# EAGLE design rf_board_v1 (EAGLE 5.11)
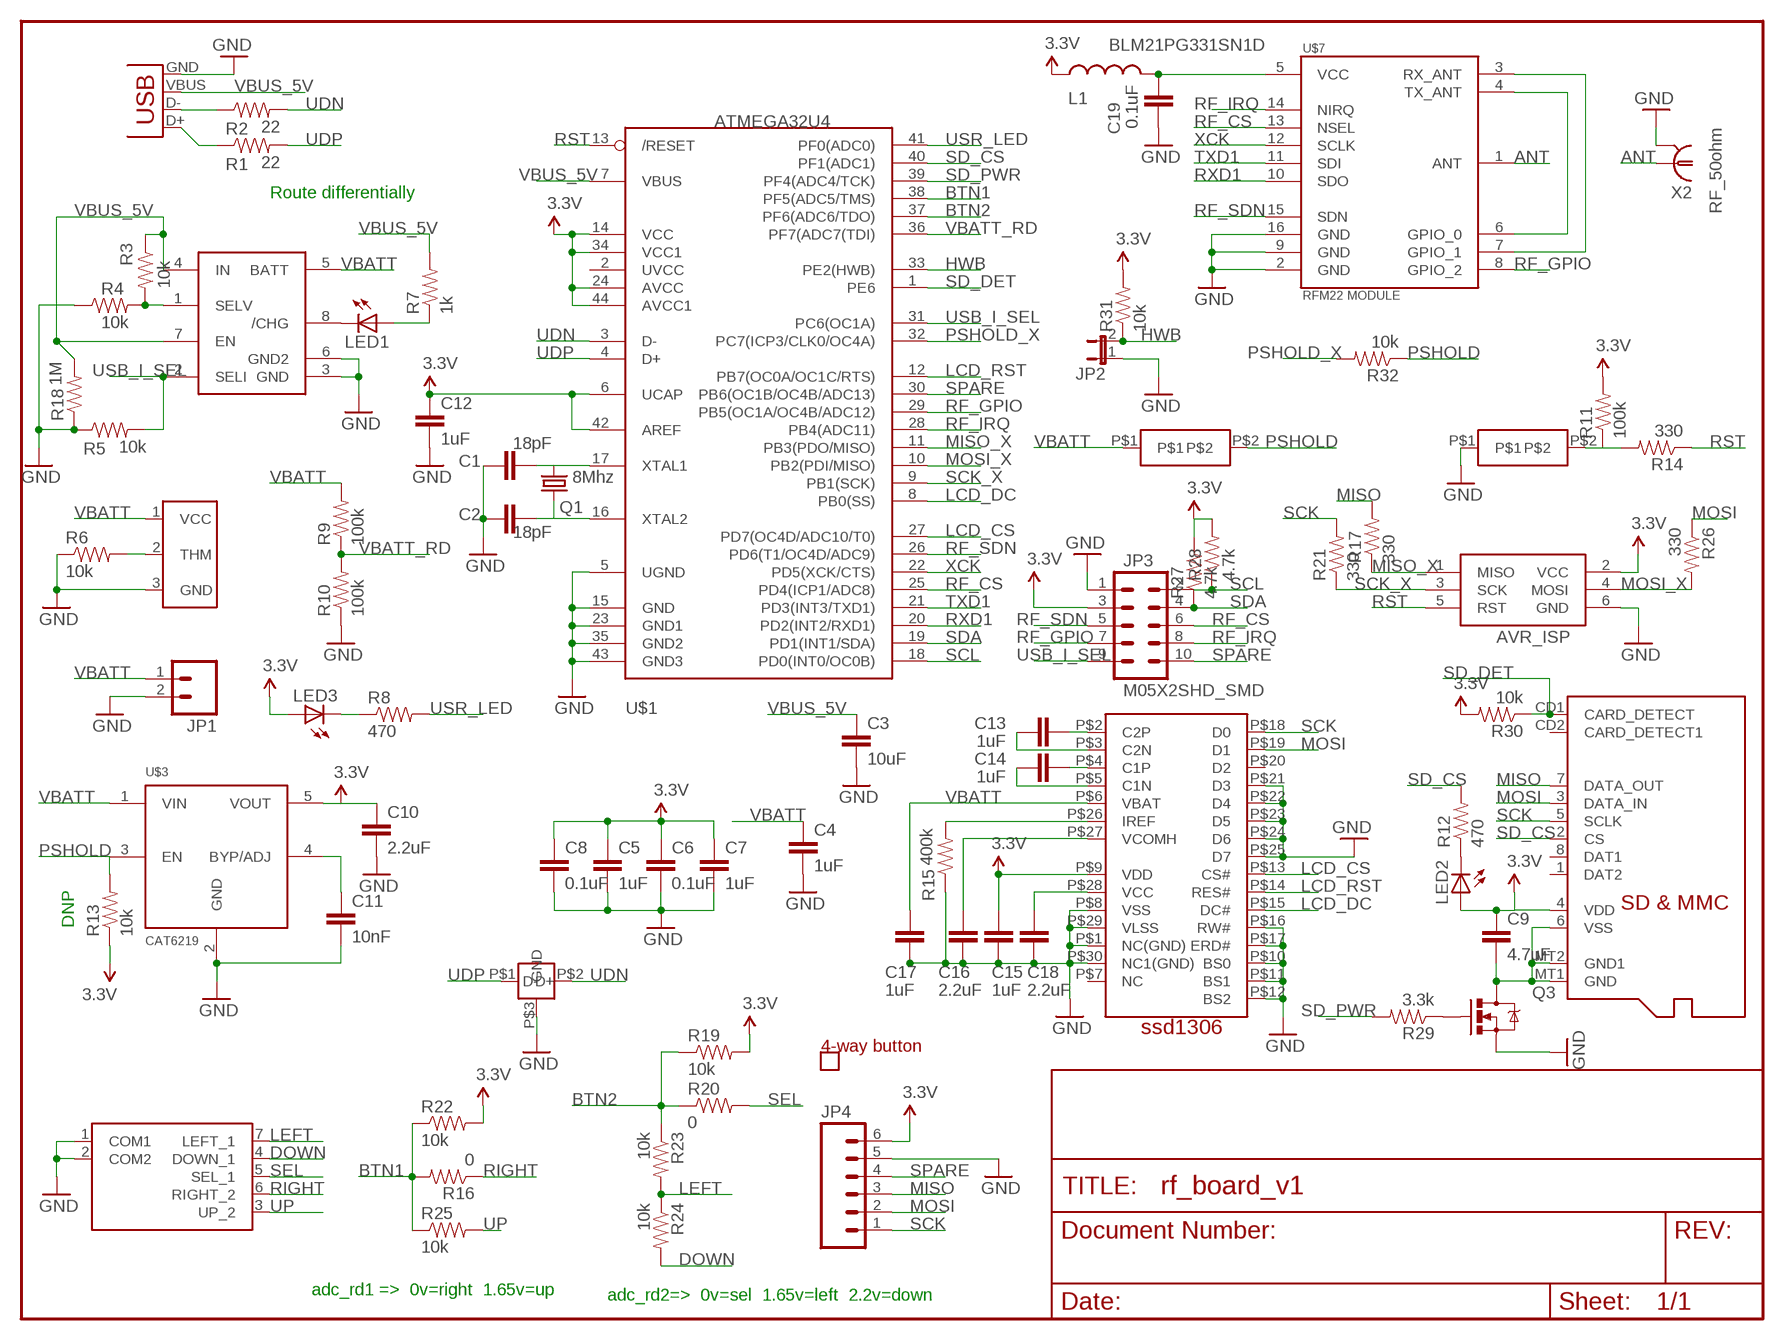
[diagram p0: schematic, sheet 1]

## Parts
AVR_ISP  AVRISP-6  [AVRISP]
C1  18pF  CAP0603-CAP  [0603-CAP]
C2  18pF  CAP0603-CAP  [0603-CAP]
C3  10uF  CAP0805  [0805]
C4  1uF  CAP0805  [0805]
C5  1uF  CAP0805  [0805]
C6  0.1uF  CAP0805  [0805]
C7  1uF  CAP0805  [0805]
C8  0.1uF  CAP0805  [0805]
C9  4.7uF  CAP0805  [0805]
C10  2.2uF  CAP0805  [0805]
C11  10nF  CAP0805  [0805]
C12  1uF  CAP0805  [0805]
C13  1uF  CAP0805  [0805]
C14  1uF  CAP0805  [0805]
C15  1uF  CAP0805  [0805]
C16  2.2uF  CAP0805  [0805]
C17  1uF  CAP0805  [0805]
C18  2.2uF  CAP0805  [0805]
C19  0.1uF  CAP0805  [0805]
JP1  M02PTH4  [1X02_XTRA_BIG]
JP2  JUMPER-2PTH_LOCK  [1X02_LOCK]
JP3  M05X2SHD_SMD  [2X5-SHROUDED_SMD]
JP4  M06LOCK  [1X06_LOCK]
L1  BLM21PG331SN1D  INDUCTOR0805  [0805]
LED1  LED1206  [LED-1206]
LED2  LED1206  [LED-1206]
LED3  LED1206  [LED-1206]
MICROSD  MICROSD  [MICROSD]
Q1  8Mhz  CRYSTALSMD  [HC49UP]
Q3  NFET  MOSFET-NCHANNELSMD  [SOT23-3]
R1  22  RESISTOR  [0805]
R2  22  RESISTOR  [0805]
R3  10k  RESISTOR  [0805]
R4  10k  RESISTOR  [0805]
R5  10k  RESISTOR  [0805]
R6  10k  RESISTOR  [0805]
R7  1k  RESISTOR  [0805]
R8  470  RESISTOR  [0805]
R9  100k  RESISTOR  [0805]
R10  100k  RESISTOR  [0805]
R11  100k  RESISTOR  [0805]
R12  470  RESISTOR  [0805]
R13  10k  RESISTOR  [0805]
R14  330  RESISTOR  [0805]
R15  400k  RESISTOR  [0805]
R16  0  RESISTOR  [0805]
R17  330  RESISTOR  [0805]
R18  1M  RESISTOR  [0805]
R19  10k  RESISTOR  [0805]
R20  0  RESISTOR  [0805]
R21  330  RESISTOR  [0805]
R22  10k  RESISTOR  [0805]
R23  10k  RESISTOR  [0805]
R24  10k  RESISTOR  [0805]
R25  10k  RESISTOR  [0805]
R26  330  RESISTOR  [0805]
R27  4.7k  RESISTOR  [0805]
R28  4.7k  RESISTOR  [0805]
R29  3.3k  RESISTOR  [0805]
R30  10k  RESISTOR  [0805]
R31  10k  RESISTOR  [0805]
R32  10k  RESISTOR  [0805]
U$1  ATMEGA32U4  ATMEGA32U4-AU  [TQFP44]
U$2  MAX1811  MAX1811SO8  [SO08]
U$3  CAT6219  CAT6219-TD  [SOT23-5]
U$4  JST_CON  [JST_CON]
U$6  ESD_TPD2EUSB30ADRTR  [TPD2EUSB30ADRTR]
U$7  RFM22 MODULE  RFM22  [RFM22-XXX-S2]
U$8  TPA511GLFS  [TPA511GLFS]
U$10  SSD1306  [SSD1306]
U$11  SW_KSS343GLFG  [SW_KSS343GLFG]
U$12  SW_KSS343GLFG  [SW_KSS343GLFG]
X1  USB-MICROB  [USB-MICROB]
X2  RF_50ohm  LTI-SASF54GT  [LTI-SASF54GT]

## Nets
3.3V: AVR_ISP.2(VCC) C5.1 C6.1 C7.1 C8.1 C9.1 C10.1 C12.1 C15.2 JP3.3 JP4.6 L1.1 LED2.A LED3.A MICROSD.4(VDD) R11.2 R13.1 R19.2 R22.2 R27.2 R28.2 R30.2 R31.2 U$1.6(UCAP) U$1.14(VCC) U$1.24(AVCC) U$1.34(VCC1) U$1.42(AREF) U$1.44(AVCC1) U$3.5(VOUT) U$10.P$9(VDD)
ANT: U$7.1(ANT) X2.1
BTN1: R16.2 R22.1 R25.1 U$1.38(PF5(ADC5/TMS))
BTN2: R19.1 R20.1 R23.1 U$1.37(PF6(ADC6/TDO))
DOWN: R24.2 U$8.4(DOWN_1)
GND: AVR_ISP.6(GND) C1.1 C2.1 C3.2 C4.2 C5.2 C6.2 C7.2 C8.2 C10.2 C11.2 C12.2 C15.1 C16.1 C17.1 C18.1 C19.1 JP1.2 JP2.1 JP3.1 JP4.5 Q3.2(S) R4.1 R5.1 R6.1 R10.1 R15.1 R18.1 U$1.5(UGND) U$1.15(GND) U$1.23(GND1) U$1.35(GND2) U$1.43(GND3) U$2.3(GND) U$2.6(GND2) U$3.2(GND) U$4.3(GND) U$6.P$3(GND) U$7.2(GND) U$7.9(GND) U$7.16(GND) U$8.1(COM1) U$8.2(COM2) U$10.P$1(NC(GND)) U$10.P$8(VSS) U$10.P$10(BS0) U$10.P$11(BS1) U$10.P$12(BS2) U$10.P$16(RW#) U$10.P$17(ERD#) U$10.P$21(D3) U$10.P$22(D4) U$10.P$23(D5) U$10.P$24(D6) U$10.P$25(D7) U$10.P$29(VLSS) U$10.P$30(NC1(GND)) U$12.P$1 X1.GND X2.2(GND)
GND1: C9.2 MICROSD.6(VSS) MICROSD.MT1(GND) MICROSD.MT2(GND1) Q3.3(D)
HWB: JP2.2 R31.1 U$1.33(PE2(HWB))
LCD_CS: U$1.27(PD7(OC4D/ADC10/T0)) U$10.P$13(CS#)
LCD_DC: U$1.8(PB0(SS)) U$10.P$15(DC#)
LCD_RST: U$1.12(PB7(OC0A/OC1C/RTS)) U$10.P$14(RES#)
LEFT: R23.2 R24.1 U$8.7(LEFT_1)
MISO: JP4.3 MICROSD.7(DATA_OUT) R17.2
MISO_X: AVR_ISP.1(MISO) R17.1 U$1.11(PB3(PDO/MISO))
MOSI: JP4.2 MICROSD.3(DATA_IN) R26.1 U$10.P$19(D1)
MOSI_X: AVR_ISP.4(MOSI) R26.2 U$1.10(PB2(PDI/MISO))
N$1: R1.1 X1.D+
N$2: R2.1 X1.D-
N$3: R3.2 R4.2 U$2.1(SELV)
N$4: C1.2 Q1.2 U$1.17(XTAL1)
N$5: C2.2 Q1.1 U$1.16(XTAL2)
N$6: Q3.1(G) R29.1
N$7: LED1.C U$2.8(/CHG)
N$8: LED1.A R7.1
N$9: U$7.3(RX_ANT) U$7.7(GPIO_1)
N$10: U$7.4(TX_ANT) U$7.6(GPIO_0)
N$11: LED3.C R8.1
N$12: R11.1 R14.2 U$12.P$2
N$14: R6.2 U$4.2(THM)
N$15: LED2.C R12.1
N$16: C11.1 U$3.4(BYP/ADJ)
N$21: C13.2 U$10.P$2(C2P)
N$22: C13.1 U$10.P$3(C2N)
N$23: C14.2 U$10.P$4(C1P)
N$24: C14.1 U$10.P$5(C1N)
N$25: R15.2 U$10.P$26(IREF)
N$26: C16.2 U$10.P$27(VCOMH)
N$27: C18.2 U$10.P$28(VCC)
N$28: C19.2 L1.2 U$7.5(VCC)
PSHOLD: R13.2 R32.1 U$3.3(EN) U$11.P$2
PSHOLD_X: R32.2 U$1.32(PC7(ICP3/CLK0/OC4A))
RF_CS: JP3.6 U$1.25(PD4(ICP1/ADC8)) U$7.13(NSEL)
RF_GPIO: JP3.7 U$1.29(PB5(OC1A/OC4B/ADC12)) U$7.8(GPIO_2)
RF_IRQ: JP3.8 U$1.28(PB4(ADC11)) U$7.14(NIRQ)
RF_SDN: JP3.5 U$1.26(PD6(T1/OC4D/ADC9)) U$7.15(SDN)
RIGHT: R16.1 U$8.6(RIGHT_2)
RST: AVR_ISP.5(RST) R14.1 U$1.13(/RESET)
RXD1: U$1.20(PD2(INT2/RXD1)) U$7.10(SDO)
SCK: JP4.1 MICROSD.5(SCLK) R21.2 U$10.P$18(D0)
SCK_X: AVR_ISP.3(SCK) R21.1 U$1.9(PB1(SCK))
SCL: JP3.2 R28.1 U$1.18(PD0(INT0/OC0B))
SD_CS: MICROSD.2(CS) R12.2 U$1.40(PF1(ADC1))
SD_DET: MICROSD.CD1(CARD_DETECT) R30.1 U$1.1(PE6)
SD_PWR: R29.2 U$1.39(PF4(ADC4/TCK))
SDA: JP3.4 R27.1 U$1.19(PD1(INT1/SDA))
SEL: R20.2 U$8.5(SEL_1)
SPARE: JP3.10 JP4.4 U$1.30(PB6(OC1B/OC4B/ADC13))
TXD1: U$1.21(PD3(INT3/TXD1)) U$7.11(SDI)
UDN: R2.2 U$1.3(D-) U$6.P$2(D-)
UDP: R1.2 U$1.4(D+) U$6.P$1(D+)
UP: R25.2 U$8.3(UP_2)
USB_I_SEL: JP3.9 R5.2 U$1.31(PC6(OC1A)) U$2.2(SELI)
USR_LED: R8.2 U$1.41(PF0(ADC0))
VBATT: C4.1 C17.2 JP1.1 R9.2 U$2.5(BATT) U$3.1(VIN) U$4.1(VCC) U$10.P$6(VBAT) U$11.P$1
VBATT_RD: R9.1 R10.2 U$1.36(PF7(ADC7(TDI))
VBUS_5V: C3.1 R3.1 R7.2 R18.2 U$1.7(VBUS) U$2.4(IN) U$2.7(EN) X1.VBUS
XCK: U$1.22(PD5(XCK/CTS)) U$7.12(SCLK)
Unconnected: MICROSD.1(DAT2) MICROSD.8(DAT1) MICROSD.CD2(CARD_DETECT1) U$1.2(UVCC) U$10.P$7(NC) U$10.P$20(D2)

## Notes on the sheet
- Route differentially
- DNP
- adc_rd1 =>  0v=right  1.65v=up
- adc_rd2=>  0v=sel  1.65v=left  2.2v=down

## Power pins joined to a net without a drawn wire
GND: X2.3(GND) X2.4(GND) X2.5(GND)

## Library data of the parts
AVR_ISP = adafruit:AVRISP: AVR ISP HEADER Standard 6 pin header for AVR programming
C1-C19 = SparkFun:CAP: Capacitor Standard 0603 ceramic capacitor, and 0.1" leaded capacitor.
JP1 = SparkFun:M02: Header 2 Standard 2-pin 0.1" header. Use with straight break away headers (SKU : PRT-00116), right angle break away headers (PRT-00553), swiss pins (PRT-00743), machine pins (PRT-00117), and female headers (PRT-00115). Molex polarized connector foot print use with SKU : PRT-08233 with associated crimp pins and housings.
JP2 = SparkFun:JUMPER-2: Jumper Basic 0.1" spaced jumper. Use with breakaway headers.
JP3 = SparkFun:M05X2: Header 5x2 Standard 10-pin dual row 0.1" header. Commonly used with AVR-ISP. Use with Spark Fun Electronics SKU: PRT-00778
JP4 = SparkFun:M06: Header 6 Standard 6-pin 0.1" header. Use with straight break away headers (SKU : PRT-00116), right angle break away headers (PRT-00553), swiss pins (PRT-00743), machine pins (PRT-00117), and female headers (PRT-00115). Molex polarized connector foot print use with SKU : PRT-08094 with associated crimp pins and housings. NOTES ON THE VARIANTS LOCK and LOCK_LONGPADS... This footprint was designed to help hold the alignment of a through-hole component (i.e. 6-pin header) while soldering it into place. You may notice that each hole has been shifted either up or down by 0.005 of an inch from it's more standard position (which is a perfectly straight line). This slight alteration caused the pins (the squares in the middle) to touch the edges of the holes. Because they are alternating, it causes a "brace" to hold the component in place. 0.005 has proven to be the perfect amount of "off-center" position when using our standard breakaway headers. Although looks a little odd when you look at the bare footprint, once you have a header in there, the alteration is very hard to notice. Also, if you push a header all the way into place, it is covered up entirely on the bottom side. This idea of altering the position of holes to aid alignment will be further integrated into the Sparkfun Library for other footprints. It can help hold any component with 3 or more connection pins.
L1 = SparkFun:INDUCTOR: Inductors Basic Inductor/Choke - 0603 and 1206. Footprints are not proven and vary greatly between part numbers.
LED1-LED3 = SparkFun:LED: LEDs Standard schematic elements and footprints for 5mm, 3mm, 1206, and 0603 sized LEDs. 5mm - Spark Fun Electronics SKU : COM-00529 (and others)
MICROSD = adafruit:MICROSD: Micro-SD / Transflash card holder with SPI pinout For the 3M # 2908-05WB-MG and/or 4UCON #19656 push-push type
Q1 = SparkFun:CRYSTAL: Crystals Various standard crystals. Proven footprints. Spark Fun Electronics SKU : COM-00534
Q3 = SparkFun:MOSFET-NCHANNEL
R1-R32 = SparkFun:RESISTOR: Resistor Basic schematic elements and footprints for 0603, 1206, and PTH 1/10th watt (small) resistors.
U$1 = adafruit:ATMEGA32U4: http://www.ladyada.net/library/eagle
U$2 = adafruit:MAX1811: Maxim MAX1811 USB li-ion battery charger http://www.ladyada.net/library/eagle
U$3 = eagle-library-edeca.net-v4:CAT6219: ON Semiconductor 500mA CMOS LDO Regulator
U$4 = ebuller_custom:JST_CON
U$6 = ebuller_custom:ESD_TPD2EUSB30ADRTR
U$7 = SparkFun:RFM22: *Hope RF's RFM22* Packages: RFM22-S2 (SMD)
U$8 = ebuller_custom:TPA511GLFS
U$10 = ebuller_custom:SSD1306
U$11 U$12 = ebuller_custom:SW_KSS343GLFG
X1 = SparkFun:USB: USB Connectors USB-B-PTH is fully proven SKU : PRT-00139 USB-miniB is fully proven SKU : PRT-00587 USB-A-PCB is untested. USB-A-H is throughly reviewed, but untested. Spark Fun Electronics SKU : PRT-00437 USB-B-SMT is throughly reviewed, but untested. Needs silkscreen touching up. USB-A-S has not been used/tested USB-MB-H has not been used/tested
X2 = con-coax:LTI-SASF54GT: SMA vertical PCB thrue hole jack Source: Lighthorse Technologies, inc. SASF54GT.pdf; OC_FARNELL: unknown; OC_NEWARK: unknown

## Board
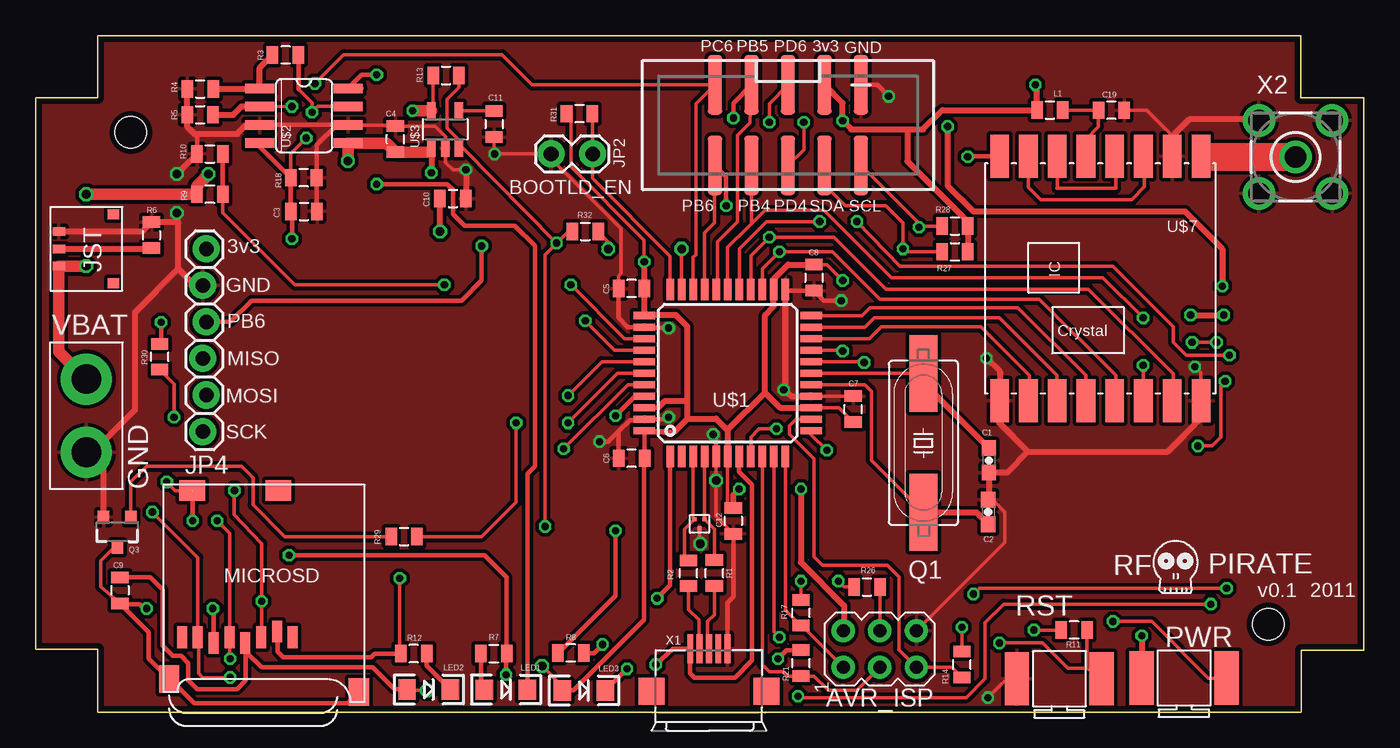
[diagram p1: board, top side]
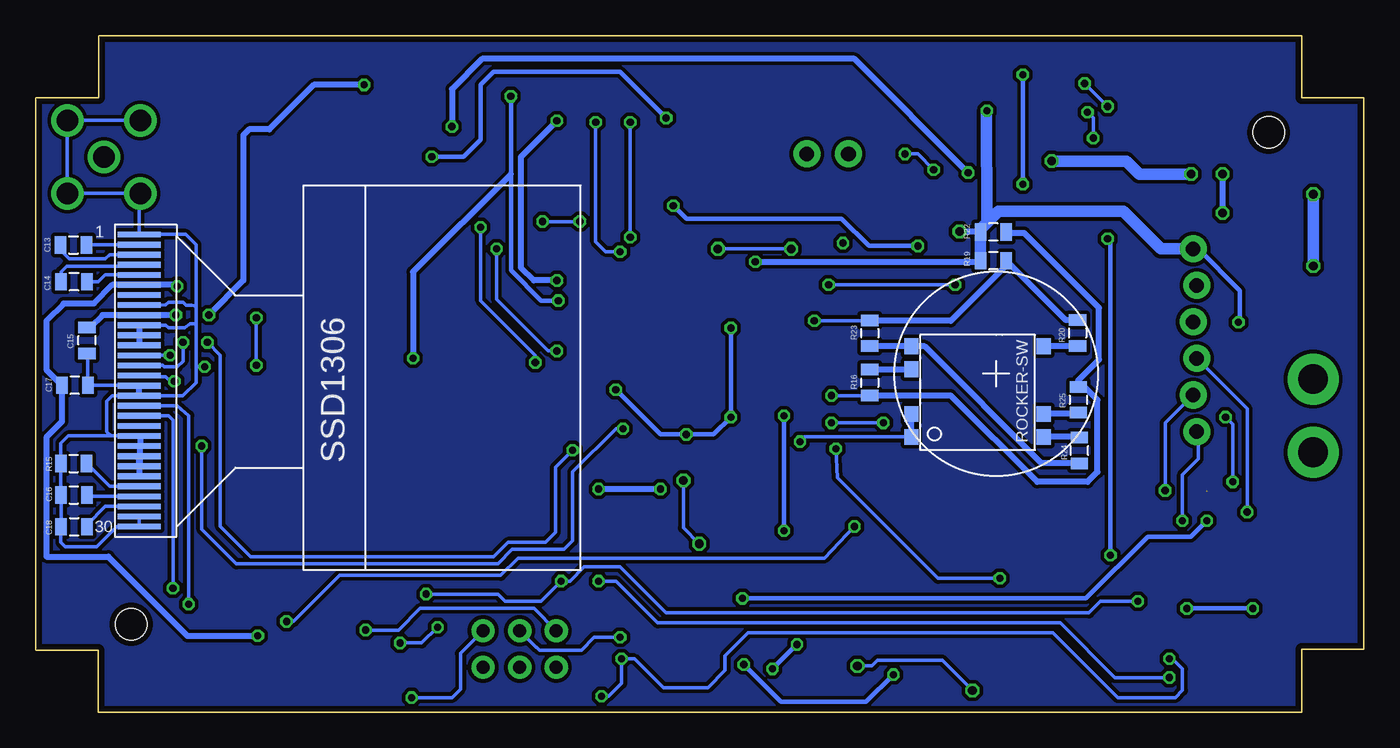
[diagram p2: board, bottom side, seen from below]

Size 92.33 x 47 mm. Coordinates in mm from the lower left corner, seen from the top.
Outline: 87.98,47 4.3,47 4.3,42.7 0,42.7 0,4.35 4.3,4.38 4.3,0 88,0 88,4.3 92.33,4.3 92.33,42.7 87.98,42.7 87.98,47
Copper layers (1*16): Top 0.0356mm / dielectric 1.5011mm / Bottom 0.0356mm
Design rules "LaenPCBOrder": minimum track width 6mil, minimum drill 13mil, track to track 6mil, track to pad 6mil, pad to pad 6mil, via to via 6mil, smd to smd 6mil, copper to edge 15mil, drill to drill 6mil, minimum pad ring 7mil, minimum via ring 7mil, stop-mask expansion 4mil, vias tented up to drill 0mil, thermal gap 10mil
Holes 2.2 mm at 85.7,6.1 6.6,40.3

### Footprints (pad centres in the part's own frame; a part is rotated, then mirrored left to right if it is on the bottom)
AVRISP = drill 0.9 pad 1.626 round: 1 -1.27,2.54; 2 1.27,2.54; 3 -1.27,0; 4 1.27,0; 5 -1.27,-2.54; 6 1.27,-2.54
0603-CAP = smd 1.1 x 1: 1 -0.85,0; 2 0.85,0
0805 = smd 0.8 x 1.2: 1 -0.9,0; 2 0.9,0
1X02_XTRA_BIG = drill 2.057 pad 3.556 round: 1 -2.54,0; 2 2.54,0
1X02_LOCK = drill 1.016 pad 1.88 round: 1 -0.178,0; 2 2.718,0
2X5-SHROUDED_SMD = smd 4.15 x 1: 1 -2.794,5.08; 2 2.794,5.08; 3 -2.794,2.54; 4 2.794,2.54; 5 -2.794,0; 6 2.794,0; 7 -2.794,-2.54; 8 2.794,-2.54; 9 -2.794,-5.08; 10 2.794,-5.08
1X06_LOCK = drill 1.016 pad 1.88 round: 1 0,0; 2 2.54,-0.254; 3 5.08,0; 4 7.62,-0.254; 5 10.16,0; 6 12.7,-0.254
LED-1206 = smd 1.2 x 1.4: A -1.5,0; C 1.5,0
MICROSD = smd 0.7 x 1.5: 1 9,-10.64; 2 7.9,-10.24; 3 6.8,-10.64; 4 5.7,-11.04; 5 4.6,-10.64; 6 3.5,-11.04; 7 2.4,-10.64; 8 1.3,-10.64 | smd 1.8 x 1.4: CD1 2,-0.44; CD2 8,-0.44 | smd 1.4 x 1.9: MT1 0.4,-13.54; MT2 13.6,-14.44
HC49UP = smd 5.334 x 1.93: 1 -4.826,0; 2 4.826,0
SOT23-3 = smd 0.8 x 0.9: 1 -0.95,-1; 2 0.95,-1; 3 0,1.1
TQFP44 = smd 1.5 x 0.5: 1 -5.8,4; 2 -5.8,3.2; 3 -5.8,2.4; 4 -5.8,1.6; 5 -5.8,0.8; 6 -5.8,0; 7 -5.8,-0.8; 8 -5.8,-1.6; 9 -5.8,-2.4; 10 -5.8,-3.2; 11 -5.8,-4; 23 5.8,-4; 24 5.8,-3.2; 25 5.8,-2.4; 26 5.8,-1.6; 27 5.8,-0.8; 28 5.8,0; 29 5.8,0.8; 30 5.8,1.6; 31 5.8,2.4; 32 5.8,3.2; 33 5.8,4 | smd 0.5 x 1.5: 12 -4,-5.8; 13 -3.2,-5.8; 14 -2.4,-5.8; 15 -1.6,-5.8; 16 -0.8,-5.8; 17 0,-5.8; 18 0.8,-5.8; 19 1.6,-5.8; 20 2.4,-5.8; 21 3.2,-5.8; 22 4,-5.8; 34 4,5.8; 35 3.2,5.8; 36 2.4,5.8; 37 1.6,5.8; 38 0.8,5.8; 39 0,5.8; 40 -0.8,5.8; 41 -1.6,5.8; 42 -2.4,5.8; 43 -3.2,5.8; 44 -4,5.8
SO08 = smd 0.66 x 2.032: 1 -1.905,-3.073; 2 -0.635,-3.073; 3 0.635,-3.073; 4 1.905,-3.073; 5 1.905,3.073; 6 0.635,3.073; 7 -0.635,3.073; 8 -1.905,3.073
SOT23-5 = smd 0.6 x 1.2: 1 -0.95,-1.306; 2 0,-1.306; 3 0.95,-1.306; 4 0.95,1.306; 5 -0.95,1.306
JST_CON = smd 0.9 x 0.6: 1 -0.5,2.8; 2 -0.5,1.6; 3 -0.5,0.4 | smd 0.8 x 0.7: S1 -4.3,4; S2 -4.3,-0.8
TPD2EUSB30ADRTR = smd 0.3 x 0.3: P$1 0.2,0.2; P$2 0.9,0.2; P$3 0.55,0.85
RFM22-XXX-S2 = smd 3 x 1.3: 1 -8.5,7; 2 -8.5,5; 3 -8.5,3; 4 -8.5,1; 5 -8.5,-1; 6 -8.5,-3; 7 -8.5,-5; 8 -8.5,-7; 9 8.5,-7; 10 8.5,-5; 11 8.5,-3; 12 8.5,-1; 13 8.5,1; 14 8.5,3; 15 8.5,5; 16 8.5,7
TPA511GLFS = smd 1 x 1.1: 1 -0.6,0.9; 2 -0.6,2.5; 3 8.6,2.5; 4 8.6,0.9; 5 8.6,7.2; 6 -0.6,5.6; 7 -0.6,7.2
SSD1306 = smd 0.4 x 3: P$1 1.1,2.1; P$2 1.8,2.1; P$3 2.5,2.1; P$4 3.2,2.1; P$5 3.9,2.1; P$6 4.6,2.1; P$7 5.3,2.1; P$8 6,2.1; P$9 6.7,2.1; P$10 7.4,2.1; P$11 8.1,2.1; P$12 8.8,2.1; P$13 9.5,2.1; P$14 10.2,2.1; P$15 10.9,2.1; P$16 11.6,2.1; P$17 12.3,2.1; P$18 13,2.1; P$19 13.7,2.1; P$20 14.4,2.1; P$21 15.1,2.1; P$22 15.8,2.1; P$23 16.5,2.1; P$24 17.2,2.1; P$25 17.9,2.1; P$26 18.6,2.1; P$27 19.3,2.1; P$28 20,2.1; P$29 20.7,2.1; P$30 21.4,2.1
SW_KSS343GLFG = smd 1.7 x 3.7: P$1 1.2,2.2; P$2 7.1,2.2
USB-MICROB = smd 0.4 x 2: D+ 0,3.1; D- -0.65,3.1; GND 1.3,3.1; ID 0.65,3.1; VBUS -1.3,3.1 | smd 1.8 x 1.9: GND@2 -4,0.15; GND@3 4,0.15
LTI-SASF54GT = drill 1.5 pad 2.2 round: 1 0,0; 2 -2.54,2.54; 3 2.54,2.54; 4 2.54,-2.54; 5 -2.54,-2.54

### Placement (x,y rotation side)
AVR_ISP  58.69,4.38 90 top
C1  66.27,17.5 90 top
C2  66.23,13.91 270 top
C3  18.64,34.8 0 top
C4  25,39.83 90 top
C5  41.42,29.44 180 top
C6  41.43,17.64 180 top
C7  56.84,21.06 90 top
C8  54.1,30.2 270 top
C9  5.85,8.46 270 top
C10  29,35.7 0 top
C11  31.86,40.87 270 top
C12  48.5,13.29 270 top
C13  89.72,32.46 0 bottom
C14  89.68,29.92 180 bottom
C15  88.78,25.84 90 bottom
C16  89.69,15.08 0 bottom
C17  89.62,22.72 180 bottom
C18  89.67,12.88 0 bottom
C19  74.79,41.83 180 top
JP1  3.5,20.6 270 top
JP2  36,38.8 0 top
JP3  52.3,40.8 270 top
JP4  11.6,19.5 90 top
L1  70.51,41.85 0 top
LED1  32.68,1.56 0 top
LED2  27.31,1.57 0 top
LED3  38.1,1.5 0 top
MICROSD  8.86,15.84 0 top
Q1  61.72,18.71 90 top
Q3  5.66,12.54 180 top
R1  47.18,9.66 90 top
R2  45.38,9.65 90 top
R3  17.36,45.68 180 top
R4  11.43,43.32 0 top
R5  11.42,41.52 0 top
R6  8.04,33.15 270 top
R7  31.84,4.06 0 top
R8  37.2,4.1 180 top
R9  12.1,36 180 top
R10  12.1,38.8 0 top
R11  72.2,5.7 180 top
R12  26.27,4.06 180 top
R13  28.52,44.26 0 top
R14  64.4,3.3 90 top
R15  89.7,17.28 0 bottom
R16  34.34,22.9 270 bottom
R17  53.2,6.9 90 top
R18  18.62,37.14 180 top
R19  25.74,31.38 180 bottom
R20  19.88,26.35 270 bottom
R21  53.2,3.4 90 top
R22  25.74,33.37 180 bottom
R23  34.34,26.33 270 bottom
R24  19.76,18.18 90 bottom
R25  19.84,21.71 270 bottom
R26  57.8,8.7 0 top
R27  63.91,31.99 0 top
R28  63.91,33.79 0 top
R29  25.6,12.2 0 top
R30  8.6,24.7 90 top
R31  37.8,41.6 180 top
R32  38.2,33.4 0 top
U$1  48.11,23.56 90 top
U$2  18.64,41.45 270 top
U$3  28.46,40.5 0 top
U$4  1.1,33.8 180 top
U$6  46.7,13.6 180 top
U$7  74.02,30.14 270 top
U$8  30.84,18.22 0 bottom
U$10  87.24,34.29 270 bottom
U$11  75.69,0.16 0 top
U$12  67.02,0.11 0 top
U$14  RF_PIRATE_LOGO  [RF_PIRATE]  80.9,9.2 0 top
X1  46.8,1.3 0 top
X2  87.6,38.59 180 top

### Tracks (layer width: path | path; a pad name or v marks a point on that pad's centre or on a via)
3.3V  (via drill 0.5 pad 0.25, 0.5 pad 0.41, 0.6)
  Top 0.254: U$1.6 48.11,14.58 C12.1 | U$1.14 55.84,21.16 C7.1 | 48.5,15.1 v48.9,15.5 | 56.2,5.7 AVR_ISP.2 | v69.4,5.7 R11.2 | R13.1 27.62,41.92 U$3.5 | v42.31,31.29 v42.3,31.3 42.3,32.8 37.2,37.9 37.2,41.3 R31.2 | 51.3,30.1 U$1.24 | C8.1 55,31.1 v56.1,30 | 69.61,43.49 v69.5,43.6 | v69.5,43.6 69.49,43.59 | v69.5,43.6 v69.49,43.59 | R27.2 R28.2 | 60.5,40.5 60.6,40.4 | 8.7,25.7 R30.2 | LED3.A 36.6,1.8 v35.2,3.2 | v27.2,1.5 25.88,1.5 LED2.A
  Top 0.305: 43.26,21.16 U$1.42 | 45.3,21.1 45.3,21.6 | 42.35,27.6 U$1.34 | U$1.24 | 48.11,19.59 48.11,19.61 | C5.1 | U$1.44 42.31,17.66 C6.1 42.3,17.61 42.3,6.4 37.4,1.5 LED3.A | v8.7,27.1 8.7,25.7 | C9.1 7.94,9.36 8.8,8.5 8.8,4.6 9.5,3.9 10.1,3.9 10.6,3.4 10.6,2.2 11.2,1.6 14,1.6 14.6,2.2 14.6,4.2 | 14.6,4.2 14.6,4.76 MICROSD.4 | LED2.A 24.93,1.57 23.4,3.1 15.7,3.1 14.6,4.2
  Top 0.406: 45.3,21.6 43.7,21.6 43.26,21.16 | 42.35,27.6 44.5,27.6 45.3,26.8 45.3,21.1 45.3,20.4 | U$1.44 44.36,19.46 45.3,20.4 | U$1.14 51.74,21.16 50.7,22.2 | 50.7,22.2 50.7,27.6 51.3,28.2 U$1.24 | U$1.6 48.11,19.59 47.3,20.4 45.3,20.4 | 48.11,19.61 50.7,22.2 | U$1.34 C5.1 v42.31,31.29 | C12.1 48.5,15.1 | v53.2,15.5 53.2,10.4 56.2,7.4 56.2,5.7 | C8.1 52.3,31.1 51.3,30.1 | JP3.3 56.1,42.33 v56.1,41.1 56.7,40.5 60.5,40.5 61.7,40.5 63.05,41.85 L1.1 69.61,43.49 | v80.3,27.6 v82.6,27.6 | R27.2 64.81,34.09 60.6,38.3 60.6,40.4 | v28.1,33.4 C10.1
  Top 0.813: v26.2,41.8 U$3.5
  Bottom 0.254: v69.4,5.7 67.1,5.7 65.6,7.2 57.7,7.2 AVR_ISP.2 | 26.72,31.3 R19.2 | 26.24,41.76 v26.2,41.8 | 88.56,26.74 C15.2 | U$10.P$9 | JP4.6 11.5,32.2 | 8.6,27.2 v8.7,27.1 | v35.2,3.2 34.2,3.2 33.8,3.6 29.3,3.6 v27.2,1.5
  Bottom 0.305: 11.5,32.2 8.6,29.3 8.6,27.2
  Bottom 0.406: v48.9,15.5 v53.2,15.5 | v42.3,31.3 26.72,31.3 | v56.1,30 57.7,30 58.6,30.9 58.6,38.6 v56.1,41.1 | 88.56,26.74 87.7,27.6 U$10.P$9 | v69.5,43.6 73,43.6 76.1,40.5 77.5,40.5 77.9,40.1 77.9,30 v80.3,27.6 | v82.6,27.6 U$10.P$9 | v28.1,33.4 26.64,33.4 R22.2
  Bottom 0.813: R19.2 R22.2 26.64,33.56 26.2,34 | 26.2,34 26.24,41.76 | 26.2,34 25.4,34.8 16.7,34.8 14.1,32.2 JP4.6
ANT
  Top 0.254: U$7.1 81.36,38.64 81.4,38.6
  Top 1.778: X2.1 87.55,38.64
  Top 1.93: 81.4,38.6 X2.1
BTN1  (via drill 0.5 pad 0.25)
  Top 0.254: U$1.38 39.36,24.36 v37,22
  Bottom 0.254: R16.2 v37,22
  Bottom 0.406: R22.1 24.77,33.3 23.6,33.3 18.4,28.1 18.4,24.5 19.84,23.06 R25.1 19.41,22.61 18.5,21.7 18.5,16.7 19.2,16 22.7,16 28.7,22 R16.2
BTN2  (via drill 0.5 pad 0.25)
  Top 0.254: U$1.37 40.24,25.16 v38.2,27.2
  Bottom 0.254: v38.2,27.2 34.37,27.2 R23.1
  Bottom 0.406: R20.1 20.71,27.25 R19.1 24.84,31.06 28.7,27.2 34.31,27.2 R23.1
DOWN
  Bottom 0.406: U$8.4 19.8,19.12 R24.2
GND  (via drill 0.5 pad 0.25, 0.6)
  Top 0.254: U$1.15 C7.2 | 66.27,14.8 C2.1 66.54,14.76 67.4,13.9 67.4,11.82 AVR_ISP.6 | U$12.P$1 67.31,2.11 v66.2,1 | C11.2 31.86,38.84 v31.9,38.8 JP2.1 35.82,38.48 40.7,33.6 40.7,30.5 40.5,30.3 40.5,29.46 C5.2 | v29.9,37.7 29,37.7 28.5,38.2 28.5,39.15 U$3.2 28.5,39.23 28.5,40 27.77,40.73 C4.2 24.93,40.8 21.7,40.8 | 81.02,20.42 U$7.16 81.02,23.58 v80.6,24 | 67,20.1 67,21.62 U$7.9 | C19.1 77.27,41.83 79.1,40 79.1,38.72 U$7.2 | U$6.P$3 46.15,12.15 v46.2,11.7 | U$1.5 v47.31,16.11 v47.3,16.1 47.3,13.6 C12.2
  Top 0.305: X1.GND 48.1,7.6 48.5,8 C12.2 | U$1.23 52.17,29.3 C8.2 54.8,28.6 v56,28.6 | v44,20.5 43.86,20.36 U$1.43 42.25,20.3 41.3,20.3 40.53,19.53 | v44,26.7 42.37,26.7 U$1.35 41.14,26.76 40.5,27.4 40.5,29.42 C5.2 | U$1.5 47.31,19.09 v47.1,19.3 | 40.53,19.53 C6.2 | v52,22.4 52.11,22.51 | v39.2,18.8 39.8,18.8 40.53,19.53 | C3.2 19.52,34.82 R18.1 19.52,39.42 20.9,40.8 21.7,40.8 U$2.6 U$2.3 | JP3.1 58.51,43.59 v59.3,42.8 | R10.1 11.2,40 11,40.2
  Top 0.406: U$1.15 52.54,21.96 v52,22.4 | R4.1 10.53,43.43 R5.1 10.52,40.68 11,40.2 14,40.2 14.6,40.8 15.55,40.8 U$2.3 | 52.11,22.51 U$1.23 | 66.27,14.8 C1.1 67.55,16.65 69,18.1 | 81.02,20.42 78.7,18.1 69,18.1 | 67,20.1 69,18.1 | Q3.2 4.71,17.05 JP1.2 3.96,18.06 6.9,21 6.9,27.8 9.9,30.8 | 79.1,40 79.1,40.1 80.2,41.2 84.99,41.2 X2.4 | U$7.9 67.02,23.68 v66.1,24.6 | U$4.3 7.39,33.4 R6.1 9.85,34.05 | JP4.5 11.04,29.66 9.9,30.8 | 9.9,30.8 9.9,34 9.85,34.05 | 9.85,34.05 9.85,34.95 v9.8,34.7 | v9.8,37.4 R10.1 | v29.9,37.7 C10.2
  Bottom 0.254: v66.2,1 63.4,1 62.8,1.6 62.8,4.08 AVR_ISP.6 | v31.9,38.8 31,38.8 v29.9,37.7 | X2.4 X2.5 X2.2 X2.3 85.14,35.97 U$10.P$1 85.11,33.19 85.1,33.2 81.9,33.2 81.2,32.5 81.2,28.2 | 81.2,27 81.2,28.2 | 81.2,27 81.6,27 82,26.7 83.1,26.7 83.3,26.9 U$10.P$10 | U$10.P$8 83.3,28.3 83.1,28.5 82.1,28.5 81.89,28.29 81.49,28.29 81.2,28.2 | 81.2,24 81.2,27 | U$10.P$23 U$10.P$22 U$10.P$21 86.1,19.2 | U$10.P$25 U$10.P$24 | 87.1,19.2 87.4,19.5 87.4,21.6 87.01,21.99 U$10.P$17 82.11,21.99 81.2,22.9 81.2,24 | 87.1,19.2 86.1,19.2 | U$10.P$16 85.17,22.72 C17.1 88.74,22.74 88.74,24.9 C15.1 | U$10.P$29 U$10.P$30 86.71,12.89 88.1,11.5 90.3,11.5 90.6,11.8 90.6,12.85 C18.1 90.57,15.06 C16.1 R15.1 90.6,18.7 90.1,19.2 87.1,19.2 | 86.1,19.2 85.09,19.19 | v80.6,24 81.2,24 | U$8.1 38.88,19.12 v39.2,18.8 | v47.3,16.1 47.3,12.8 v46.2,11.7
  Bottom 0.305: v44,26.7 v44,20.5 45.2,19.3 v47.1,19.3 48.9,19.3 v52,22.4 | v59.3,42.8 59.3,37.4 59.3,30.7 57.2,28.6 v56,28.6
  Bottom 0.406: U$8.1 U$8.2 | U$10.P$10 U$10.P$11 U$10.P$12 | U$10.P$17 U$10.P$16 | U$10.P$24 U$10.P$23 | 85.09,19.19 U$10.P$25 | v66.1,24.6 66.1,30.6 59.3,37.4 | v9.8,34.7 v9.8,37.4
  pour Top (isolate 0.254): 0,42.7 4.3,42.7 4.3,47 88,47 88,42.7 92.3,42.7 92.3,4.3 88,4.3 88,0 4.3,0 4.3,4.4 0,4.4
GND1  (via drill 0.5 pad 0.25)
  Top 0.254: Q3.3 5.44,11.44 4.5,10.5 4.5,8.71 C9.2
  Top 0.305: MICROSD.MT2 21.66,0.6 11,0.6 9.3,2.3 MICROSD.MT1 7.85,3.71 7.85,5.55 5.9,7.5 C9.2 5.91,7.5 7.2,7.5 7.5,7.2 v7.7,7.2 | MICROSD.6 12.36,7.14 v12.3,7.2
  Bottom 0.305: v7.7,7.2 v12.3,7.2
HWB
  Top 0.254: U$1.33 44.11,31.69 38.7,37.1 38.7,38.78 JP2.2 38.7,38.82 R31.1
LCD_CS  (via drill 0.5 pad 0.25)
  Top 0.254: U$1.27 48.91,32.21 50.8,34.1 v54.5,34.1 | v57.1,34.1 60.1,31 74.9,31 79.1,26.8 79.1,25.7 80,24.8 v83,24.8
  Bottom 0.254: v54.5,34.1 v57.1,34.1 | v83,24.8 85.03,24.8 U$10.P$13
LCD_DC  (via drill 0.5 pad 0.25)
  Top 0.254: U$1.8 49.71,19.11 50.3,19.7 v51.5,19.7 | v80.8,18.5 81.8,18.5 82.4,19.1 82.4,22.7 v82.7,23
  Bottom 0.254: v51.5,19.7 52,19.7 55,16.7 55,11.9 55.6,11.3 59.2,11.3 60.2,10.3 78.4,10.3 80.8,12.7 v80.8,18.5 | v82.7,23 83,23 83.3,23.3 85.05,23.3 U$10.P$15
LCD_RST  (via drill 0.5 pad 0.25)
  Top 0.254: v80.4,25.7 v82.1,25.7 | U$1.12 53.91,19.29 v55,18.2
  Bottom 0.254: v55,18.2 56.2,17 56.2,12.5 56.9,11.8 59.5,11.8 60.5,10.8 77.4,10.8 79.5,12.9 79.5,24.8 v80.4,25.7 | v82.1,25.7 82.1,24.4 82.5,24 83.4,24 83.5,24.1 U$10.P$14
LEFT
  Bottom 0.406: R24.1 19.78,17.3 22.4,17.3 30.52,25.42 U$8.7 R23.2
MISO  (via drill 0.5 pad 0.25, 0.5 pad 0.41)
  Top 0.254: v53.2,9.1 R17.2 | v13.5,2.4 11.6,2.4 11.3,2.7 11.3,5.16 MICROSD.7 11.26,10.74 v8.1,13.9
  Bottom 0.254: v53.2,9.1 52,9.1 49.1,6.2 21.1,6.2 17.3,2.4 v13.5,2.4 | v8.1,13.9 8.1,21.08 JP4.3
MISO_X
  Top 0.254: U$1.11 52.11,7.09 R17.1 53.26,6 AVR_ISP.1
MOSI  (via drill 0.5 pad 0.25, 0.5 pad 0.41)
  Top 0.254: R26.1 56.2,8.7 v55.8,9.1 | MICROSD.3 15.7,5.24 v15.7,7.7 15.7,11.7 13.8,13.7 v13.8,15.4 | v82.8,8.6 65.6,8.6 v65.2,8.2
  Bottom 0.254: v15.7,7.7 18.3,7.7 19.1,6.9 48.5,6.9 51.7,10.1 54.2,10.1 55.2,9.1 v55.8,9.1 57.2,7.7 59.7,7.7 60.2,8.2 v65.2,8.2 | U$10.P$19 83.09,20.59 82.8,20.3 v82.8,8.6 | v13.8,15.4 13.8,20.09 JP4.2
MOSI_X  (via drill 0.5 pad 0.25)
  Top 0.254: U$1.10 51.31,5.59 v51.7,5.2 | R26.2 AVR_ISP.4
  Bottom 0.254: v51.7,5.2 53.5,5.2 54.4,4.3 57.3,4.3 57.5,4.5 57.54,4.5 AVR_ISP.4
N$1
  Top 0.254: R1.1 47.18,6.78 46.7,6.3 46.7,4.3 X1.D+
N$2
  Top 0.254: R2.1 45.38,7.12 46.1,6.4 46.1,4.25 X1.D-
N$3
  Top 0.406: R4.2 15.53,43.32 U$2.1 15.57,44.79 R3.2
N$4
  Top 0.254: U$1.17 61.7,23.56 Q1.2 61.72,22.9
  Top 0.406: 61.72,22.9 C1.2
N$5
  Top 0.254: U$1.16 57.64,22.76 58.1,22.3 58.1,17.5 Q1.1
  Top 0.406: Q1.1 65.41,13.88 C2.2
N$6
  Top 0.254: R29.1 17.3,12.2 15.1,14.4 15.1,16.3 14.3,17.1 7.7,17.1 6.6,16 Q3.1
N$7  (via drill 0.5 pad 0.25)
  Top 0.305: 22.66,43.36 U$2.8 22.66,44.3 v23.7,44.3 | LED1.C 34.18,16.58 34.7,17.1 34.7,32.4 33.3,33.8 29.8,33.8 29,34.6 29,36.3 28.6,36.7 v23.7,36.7
  Bottom 0.305: v23.7,36.7 v23.7,44.3
N$8
  Top 0.305: R7.1 30.94,1.8 LED1.A
N$9
  Top 0.254: U$7.7 69.02,36.48 69.9,35.6 76.2,35.6 77.1,36.5 77.1,38.56 U$7.3
N$10
  Top 0.254: U$7.6 71.02,36.42 71,36.4 75.1,36.4 75.1,38.56 U$7.4
N$11  (via drill 0.5 pad 0.25)
  Top 0.305: R8.1 38.8,4.1 v39.4,4.7 | LED3.C v41.1,3
  Bottom 0.305: v41.1,3 v39.4,4.7
N$12  (via drill 0.5 pad 0.25)
  Top 0.254: 73.1,3.03 R11.1 | 73.1,3.03 U$12.P$2 | 73.1,3.03 71.77,3.03 70,4.8 v67,4.8 | R14.2 v64.4,5.9
  Bottom 0.254: v67,4.8 65.5,4.8 v64.4,5.9
N$13
  pour Bottom (isolate 0.254): 0,42.7 4.3,42.7 4.3,47 88,47 88,42.7 92.3,42.7 92.3,4.3 88,4.3 88,0 4.3,0 4.3,4.4 0,4.4
N$14
  Top 0.406: U$4.2 8.04,32.2 R6.2
N$15
  Top 0.305: R12.1 27.17,3.21 LED2.C
N$16
  Top 0.254: U$3.4 31.82,41.81 C11.1
N$21
  Bottom 0.254: U$10.P$2 88.79,32.49 C13.2
N$22
  Bottom 0.254: C13.1 90.62,32.12 90,31.5 87.5,31.5 87.2,31.8 U$10.P$3
N$23
  Bottom 0.254: C14.2 90.58,30.62 90.2,31 85.23,31 U$10.P$4
N$24
  Bottom 0.254: C14.1 87.98,29.92 87.5,30.4 U$10.P$5
N$25
  Bottom 0.254: R15.2 88.78,17.28 87.2,15.7 U$10.P$26
N$26
  Bottom 0.254: C16.2 88.78,14.98 88.8,15 U$10.P$27
N$27
  Bottom 0.254: C18.2 88.77,13.03 87.5,14.3 U$10.P$28
N$28
  Top 0.254: L1.2 73.87,41.85 C19.2 73.89,40.69 73,39.8 73,38.66 U$7.5
PSHOLD  (via drill 0.5 pad 0.25)
  Top 0.254: U$11.P$2 81.54,2.36 77.6,6.3 v74.9,6.3 | v35.4,12.9 35.4,31.8 v36.2,32.6 | R13.2 29.42,43.42 28.6,42.6 28.6,40.6 29.4,39.8 29.4,39.2 U$3.3 29.71,39.19 v36.2,32.6 | R32.1 36.9,33.3 v36.2,32.6
  Bottom 0.254: v74.9,6.3 74.4,6.3 71.2,9.5 60,9.5 58.8,10.7 37.5,10.7 v35.4,12.9
PSHOLD_X  (via drill 0.6)
  Top 0.254: U$1.32 44.91,32.09 v44.9,32.2 | v39.8,32.2 39.8,32.7 R32.2
  Bottom 0.254: v39.8,32.2 v44.9,32.2
RF_CS  (via drill 0.5 pad 0.25)
  Top 0.254: U$1.25 50.51,30.81 v51.7,32 55.4,32 58.7,28.7 69.8,28.7 75.1,23.4 75.1,21.72 U$7.13 | v53.4,41 53.4,39.11 JP3.6
  Bottom 0.254: v51.7,32 52.7,32 53.4,32.7 v53.4,41
RF_GPIO  (via drill 0.5 pad 0.25)
  Top 0.254: JP3.7 49.66,40.96 48.8,40.1 48.8,34.1 47.4,32.7 47.4,29.45 U$1.29
  Top 0.305: U$7.8 64.84,38.64 v64.8,38.6 | v48.5,41.3 48.5,42.33 JP3.7
  Bottom 0.305: v64.8,38.6 62.6,38.6 61.4,39.8 61.4,43.6 60.5,44.5 51.7,44.5 v48.5,41.3
RF_IRQ  (via drill 0.5 pad 0.25)
  Top 0.254: U$1.28 48.11,32.31 49.55,33.75 49.76,33.96 | 49.76,33.96 50.7,34.9 54.8,34.9 59.5,30.2 74.2,30.2 v77,27.4 | v77,24.1 77,21.66 U$7.14 | 49.76,33.96 JP3.8
  Bottom 0.254: v77,27.4 v77,24.1
RF_SDN  (via drill 0.5 pad 0.25)
  Top 0.254: U$1.26 49.71,31.71 v51,33 55.5,33 59.1,29.4 73.2,29.4 79.1,23.5 79.1,21.72 U$7.15 | v51,41 51,42.29 JP3.5
  Bottom 0.254: v51,33 v51,41
RIGHT
  Bottom 0.406: R16.1 31.46,23.8 U$8.6
RST
  Top 0.254: U$1.13 52.86,20.36 52.4,19.9 52.4,19.3 54.1,17.6 54.1,10.8 54.7,10.2 59.2,10.2 60,9.4 60,4.34 AVR_ISP.5 63.69,3.11 R14.1
RXD1
  Top 0.254: U$1.20 57.96,25.96 58.8,26.8 65.7,26.8 69.1,23.4 69.1,21.72 U$7.10
SCK  (via drill 0.5 pad 0.25, 0.5 pad 0.41)
  Top 0.254: v13.5,3.7 13.46,3.74 MICROSD.5 13.46,12.44 v12.6,13.3 | v81.7,7.5 67.3,7.5 66,6.2 66,2.3 64.7,1 53.1,1 v53,1.1
  Top 0.305: R21.2 52.2,4.3 v51.6,3.7
  Bottom 0.254: v13.5,3.7 13.3,3.7 12.6,3 12.6,1.5 13.1,1 17.1,1 21.6,5.5 42.8,5.5 44.4,3.9 44.4,2.9 45.6,1.7 48.7,1.7 50.7,3.7 v51.6,3.7 51.6,2 52.5,1.1 v53,1.1 | U$10.P$18 82.49,21.29 81.7,20.6 v81.7,7.5 | v12.6,13.3 12.6,16.5 11.5,17.6 11.5,19.4 JP4.1
SCK_X
  Top 0.254: U$1.9 50.51,3.29 51,2.8 52,2.8 52.3,2.5 R21.1 54.1,2.5 55.1,1.5 57.08,1.5 AVR_ISP.3
SCL  (via drill 0.5 pad 0.25)
  Top 0.254: U$1.18 57.54,24.36 v57.6,24.3 | JP3.2 61.4,33.99 v61.4,33.7 61.49,33.79 R28.1
  Bottom 0.254: v57.6,24.3 57.6,24.8 61.4,28.6 v61.4,33.7
SD_CS  (via drill 0.5 pad 0.25)
  Top 0.254: U$1.40 41.16,22.74 v36.7,18.3 | v25.3,9.3 25.3,4.43 R12.2
  Top 0.305: R12.2 23.56,4.06 23.3,3.8 17.2,3.8 16.8,4.2 16.8,5.56 MICROSD.2
  Bottom 0.254: v36.7,18.3 36.6,16.3 29.6,9.3 v25.3,9.3
SD_DET  (via drill 0.5 pad 0.25, 0.5 pad 0.41)  (1 unrouted)
  Top 0.254: MICROSD.CD1 9.7,15.4 v9.1,16 | v9.6,20.5 9.6,22.8 R30.1
  Top 0.305: U$1.1 44.11,8.81 v43.2,7.9 | v10.9,13.3 10.9,15.36
  Bottom 0.254: v9.1,16 9.1,20 v9.6,20.5
  Bottom 0.305: v43.2,7.9 19.3,7.9 15,12.2 12,12.2 v10.9,13.3
SD_PWR  (via drill 0.5 pad 0.25)
  Top 0.254: U$1.39 40.46,23.56 v37,20.1 | v33.4,20.1 33.4,14.6 31,12.2 R29.2
  Bottom 0.254: v33.4,20.1 v37,20.1
SDA  (via drill 0.5 pad 0.25)
  Top 0.254: U$1.19 56.04,25.16 v56.1,25.1 | JP3.4 54.8,37.97 54.8,36.7 56.3,35.2 59.1,35.2 60.3,34 v60.3,32.2 60.51,31.99 R27.1
  Bottom 0.254: v56.1,25.1 56.7,25.1 60.3,28.7 v60.3,32.2
SEL
  Bottom 0.406: U$8.5 19.91,25.42 R20.2
SPARE  (via drill 0.5 pad 0.41)
  Top 0.254: U$1.30 46.51,33.31 47.2,34 47.2,37.99 JP3.10
  Top 0.305: JP4.4 13.52,27.12 15,28.6 29.6,28.6 31,30 v31,32.4 | v48,35.2 48,37.23 JP3.10
  Bottom 0.305: v31,32.4 34.4,32.4 36.3,34.3 47.1,34.3 v48,35.2
TXD1
  Top 0.254: U$1.21 57.66,26.76 58.3,27.4 67,27.4 71,23.4 71,21.66 U$7.11
UDN
  Top 0.254: U$1.3 45.71,13.49 U$6.P$2 45.1,12.7 45.1,10.87 R2.2
UDP
  Top 0.254: U$1.4 U$6.P$1 47.2,12.7 47.2,10.58 R1.2
UP
  Bottom 0.406: U$8.3 19.93,20.72 R25.2
USB_I_SEL  (via drill 0.5 pad 0.25)
  Top 0.254: U$1.31 45.71,31.61 45.9,31.8 45.9,42.27 JP3.9 34.51,43.59 32.4,45.7 21.4,45.7 v19.4,43.7 | v17.8,42.1 17.8,42.12 U$2.2
  Top 0.406: R5.2 13.72,41.52 14.3,42.1 15.55,42.1 U$2.2
  Bottom 0.254: v17.8,42.1 v19.4,43.7
USR_LED  (via drill 0.5 pad 0.25)
  Top 0.305: U$1.41 41.66,21.96 v40.3,20.6 | v40.3,12.6 40.3,8.1 R8.2
  Bottom 0.305: v40.3,12.6 v40.3,20.6
VBATT  (via drill 0.5 pad 0.25, 0.6)
  Top 0.254: 27.25,38.93 U$3.1 | U$11.P$1
  Top 0.305: U$3.1
  Top 0.406: v76.9,5.3 U$11.P$1 | v82.5,29.6 82.5,32.2 79.9,34.8 65.2,34.8 63.4,36.6 v63.4,40.7 | U$3.1 v27.5,37.5 | R9.2 11.2,36.6 | 21.7,39.53 U$2.5
  Top 0.813: 27.25,38.93 C4.1 24.39,39.55 U$2.5 | JP1.1 1.6,25.04 U$4.1 v3.5,31 | v3.5,36 R9.2 | 11.2,36.6 v12,37.4 | v21.7,38.3 21.7,39.53
  Bottom 0.305: v82.5,29.6 82.59,29.69
  Bottom 0.406: v76.9,5.3 81.8,5.3 87.3,10.8 91.6,10.8 91.6,19.1 90.52,20.18 C17.2 91.6,23.8 91.6,27.2 90.4,28.4 88.3,28.4 87.01,29.69 U$10.P$6 82.59,29.69 | v63.4,40.7 63.4,43.3 61.3,45.4 35.4,45.4 v27.5,37.5
  Bottom 0.813: v3.5,31 v3.5,36 | v12,37.4 15.6,37.4 16.5,38.3 v21.7,38.3
VBATT_RD  (via drill 0.5 pad 0.25)
  Top 0.254: U$1.36 40.94,25.96 v37.2,29.7 | v28.4,29.7 18,29.7 13,34.7 R9.1
  Top 0.305: R9.1 R10.2
  Bottom 0.254: v28.4,29.7 v37.2,29.7
VBUS_5V  (via drill 0.5 pad 0.25)
  Top 0.254: R18.2 17.72,38.82 v18.8,39.9 | 18.26,43.3 19.2,42.34 v19.2,41.7 19.6,42.1 21.7,42.1
  Top 0.305: U$1.7 48.9,16.7 49.8,15.8 49.8,3.6 48.6,2.4 45.8,2.4 45.5,2.7 X1.VBUS 44.3,4.4 v43.1,3.3 | v32.7,2.6 32.7,4.02 R7.2 32.74,9.36 31.2,10.9 v17.6,10.9 | v17.8,32.9 17.8,34.74 C3.1 17.72,34.82 R18.2 15.57,39.29 U$2.4 | 18.26,43.3 R3.1 | 21.7,42.1 U$2.7
  Bottom 0.254: v18.8,39.9 18.8,41.3 v19.2,41.7
  Bottom 0.305: v43.1,3.3 40.5,0.7 34.6,0.7 v32.7,2.6 | v17.6,10.9 17.6,32.7 v17.8,32.9
XCK
  Top 0.254: U$1.22 57.46,27.56 58,28.1 68.3,28.1 73,23.4 73,21.66 U$7.12

### Text on the board
tPlace: PC6 | PB5 | PD6 | PB6 | PB4 | PD4 | 3v3 | GND | PB6 | VBAT | MISO | MOSI | GND | SCK | RST | 2011 | PWR
tNames: 3v3 | GND | BOOTLD_EN | SDA | SCL | v0.1